# EAGLE design Joystick Controller (EAGLE 6.5.0)
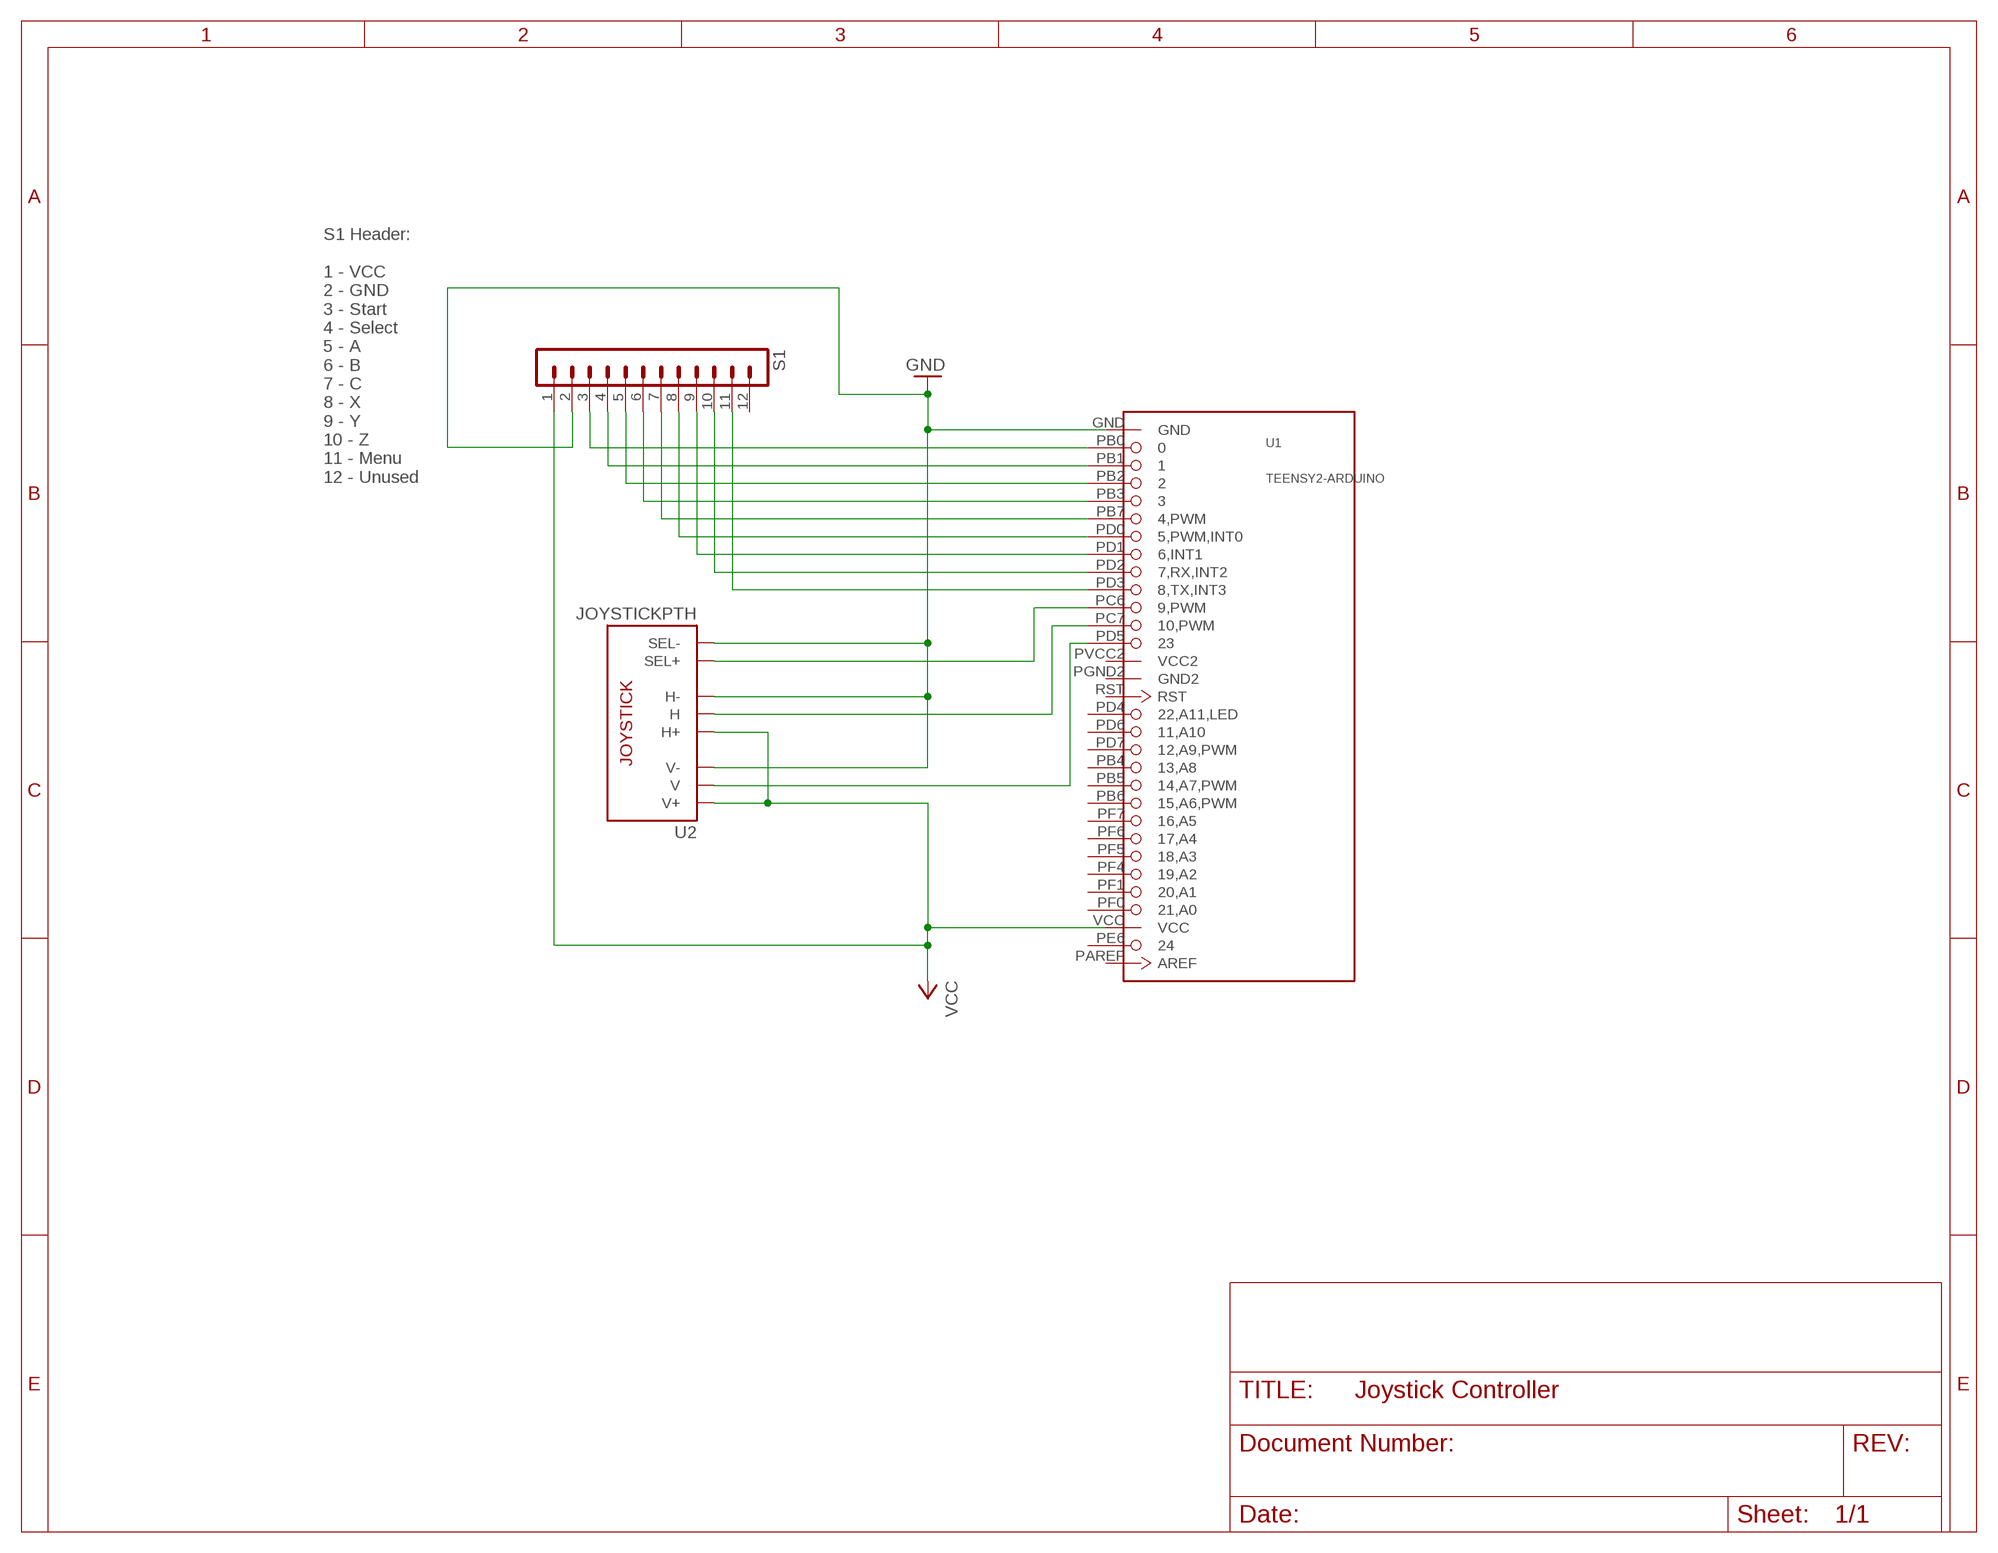
[diagram p0: schematic, sheet 1]

## Parts
S1  MA12-1  [MA12-1]
U1  TEENSY2-ARDUINO  [TEENSY2]
U2  JOYSTICKPTH  [JOYSTICK]

## Nets
GND: S1.2 U1.GND U2.B2A(SEL-) U2.H3(H-) U2.V3(V-)
N$1: U1.PC6(9,PWM) U2.B1A(SEL+)
N$2: U1.PC7(10,PWM) U2.H2(H)
N$3: U1.PD5 U2.V2(V)
N$4: S1.3 U1.PB0
N$5: S1.4 U1.PB1
N$6: S1.5 U1.PB2
N$7: S1.6 U1.PB3
N$8: S1.7 U1.PB7(4,PWM)
N$9: S1.8 U1.PD0(5,PWM,INT0)
N$10: S1.9 U1.PD1(6,INT1)
N$11: S1.10 U1.PD2(7,RX,INT2)
N$12: S1.11 U1.PD3(8,TX,INT3)
VCC: S1.1 U1.VCC U2.H1(H+) U2.V1(V+)
Unconnected: S1.12 U1.PAREF(AREF) U1.PB4(13,A8) U1.PB5(14,A7,PWM) U1.PB6(15,A6,PWM) U1.PD4(22,A11,LED) U1.PD6(11,A10) U1.PD7(12,A9,PWM) U1.PE6 U1.PF0(21,A0) U1.PF1(20,A1) U1.PF4(19,A2) U1.PF5(18,A3) U1.PF6(17,A4) U1.PF7(16,A5) U1.RST

## Notes on the sheet
- S1 Header:
  
  1 - VCC
  2 - GND
  3 - Start
  4 - Select
  5 - A
  6 - B
  7 - C
  8 - X
  9 - Y
  10 - Z
  11 - Menu
  12 - Unused

## Power pins joined to a net without a drawn wire
GND2: U1.PGND2(GND2)
VCC2: U1.PVCC2(VCC2)

## Library data of the parts
S1 = con-lstb:MA12-1: PIN HEADER; OC_FARNELL: unknown; OC_NEWARK: unknown
U1 = teensy2:TEENSY2-ARDUINO
U2 = SparkFun-Electromechanical:JOYSTICK: Thumb Joystick Joystick commonly found in PS2 controllers. Two pots and a select switch. Footprint proven. Spark Fun Electronics SKU : COM-09032

## Board
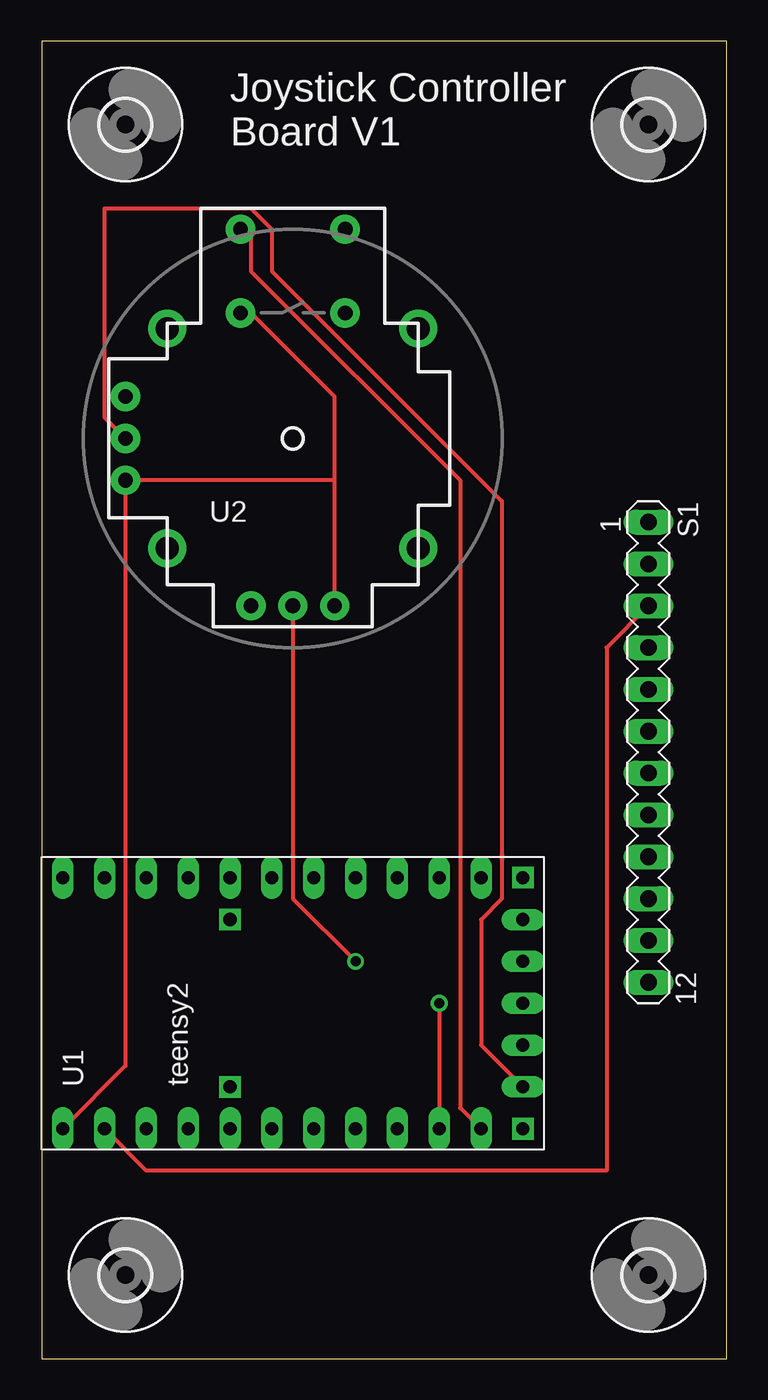
[diagram p1: board, top side]
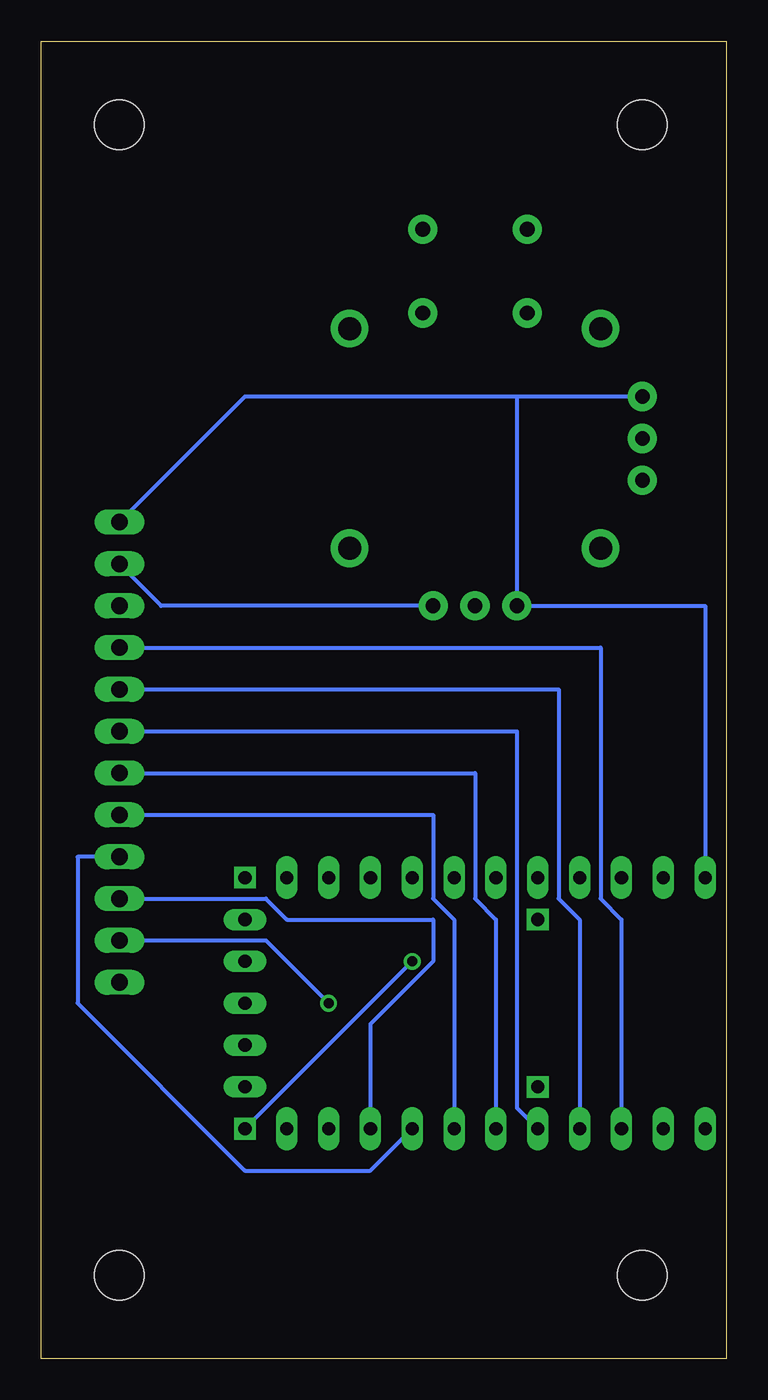
[diagram p2: board, bottom side, seen from below]

Size 41.58 x 80 mm. Coordinates in mm from the lower left corner, seen from the top.
Outline: 0,0 41.58,0 41.58,80 0,80 0,0
Copper layers (1*16): Top 0.035mm / dielectric 1.5mm / Bottom 0.035mm
Design rules "default": minimum track width 10mil, minimum drill 24mil, track to track 8mil, track to pad 8mil, pad to pad 8mil, via to via 8mil, smd to smd 8mil, copper to edge 40mil, drill to drill 8mil, minimum pad ring 10mil, minimum via ring 8mil, stop-mask expansion 4mil, vias tented up to drill 0mil, thermal gap 10mil

### Footprints (pad centres in the part's own frame; a part is rotated, then mirrored left to right if it is on the bottom)
MA12-1 = drill 1.016 long: 1 -13.97,0; 2 -11.43,0; 3 -8.89,0; 4 -6.35,0; 5 -3.81,0; 6 -1.27,0; 7 1.27,0; 8 3.81,0; 9 6.35,0; 10 8.89,0; 11 11.43,0; 12 13.97,0
TEENSY2 = drill 0.8 long: GND 12.7,21.59; PB0 12.7,19.05; PB1 12.7,16.51; PB2 12.7,13.97; PB3 12.7,11.43; PB4 27.94,-1.27; PB5 27.94,1.27; PB6 27.94,3.81; PB7 12.7,8.89; PC6 12.7,-3.81; PD0 12.7,6.35; PD1 12.7,3.81; PD2 12.7,1.27; PD3 12.7,-1.27; PD4 25.4,-6.35; PD5 15.24,-6.35; PD7 27.94,-3.81; PF0 27.94,19.05; PF1 27.94,16.51; PF4 27.94,13.97; PF5 27.94,11.43; PF6 27.94,8.89; PF7 27.94,6.35; PGND2 20.32,-6.35; PVCC2 17.78,-6.35; RST 22.86,-6.35; VCC 27.94,21.59 | drill 0.8 square: PAREF 25.4,11.43; PC7 12.7,-6.35; PD6 27.94,-6.35; PE6 15.24,11.43
JOYSTICK = drill 0.9 pad 1.778: B1A -3.175,12.7; B1B 3.175,12.7; B2A -3.175,7.62; B2B 3.175,7.62 | drill 0.889 pad 1.778: H1 -2.54,-10.16; H2 0,-10.16; H3 2.54,-10.16; V1 -10.16,2.54; V2 -10.16,0; V3 -10.16,-2.54 | drill 1.397 pad 2.286: MOUNT1 -7.62,6.668; MOUNT2 -7.62,-6.668; MOUNT3 7.62,-6.668; MOUNT4 7.62,6.668
3,0 = hole 3: 0,0

### Placement (x,y rotation side)
S1  36.83,36.83 270 top
U1  22.86,1.27 90 top
U2  15.24,55.88 0 top
U$1  [3,0]  5.08,5.08 0 top
U$2  [3,0]  36.83,5.08 0 top
U$3  [3,0]  36.83,74.93 0 top
U$4  [3,0]  5.08,74.93 0 top

### Tracks (layer width: path | path; a pad name or v marks a point on that pad's centre or on a via)
GND
  Top 0.254: U1.GND 5.08,17.78 U2.V3 17.78,53.34 | U2.H3 17.78,53.34 | 17.78,53.34 17.78,58.42 12.7,63.5 U2.B2A
  Bottom 0.254: S1.2 34.29,45.72 U2.H3
N$1
  Top 0.254: U1.PC6 25.4,15.24 25.4,53.34 12.7,66.04 12.7,68.58 U2.B1A
N$2  (via drill 0.61)
  Top 0.254: v19.05,24.13 15.24,27.94 U2.H2
  Bottom 0.254: v19.05,24.13 U1.PC7
N$3
  Top 0.254: U1.PD5 26.67,19.05 26.67,26.67 27.94,27.94 27.94,52.07 13.97,66.04 13.97,68.58 12.7,69.85 3.81,69.85 3.81,57.15 U2.V2
N$4
  Top 0.254: U1.PB0 6.35,11.43 34.29,11.43 34.29,43.18 S1.3
N$5
  Bottom 0.254: U1.PB1 6.35,26.67 7.62,27.94 7.62,43.18 S1.4
N$6
  Bottom 0.254: U1.PB2 8.89,26.67 10.16,27.94 10.16,40.64 S1.5
N$7
  Bottom 0.254: U1.PB3 12.7,15.24 12.7,38.1 S1.6
N$8
  Bottom 0.254: U1.PB7 13.97,26.67 15.24,27.94 15.24,35.56 S1.7
N$9
  Bottom 0.254: U1.PD0 16.51,26.67 17.78,27.94 17.78,33.02 S1.8
N$10
  Bottom 0.254: U1.PD1 21.59,11.43 29.21,11.43 39.37,21.59 39.37,30.48 S1.9
N$11
  Bottom 0.254: U1.PD2 21.59,20.32 17.78,24.13 17.78,26.67 26.67,26.67 27.94,27.94 S1.10
N$12  (via drill 0.61)
  Top 0.254: v24.13,21.59 U1.PD3
  Bottom 0.254: v24.13,21.59 27.94,25.4 S1.11
VCC
  Bottom 0.254: U1.VCC 1.27,45.72 U2.H1 12.7,58.42 | S1.1 29.21,58.42 12.7,58.42 | U2.V1 12.7,58.42

### Text on the board
tNames: Joystick Controller / Board V1